# Altium schematic sheet Voltage_Sensing.SchDoc
size A; SheetNumber: 7; SheetTotal: 9
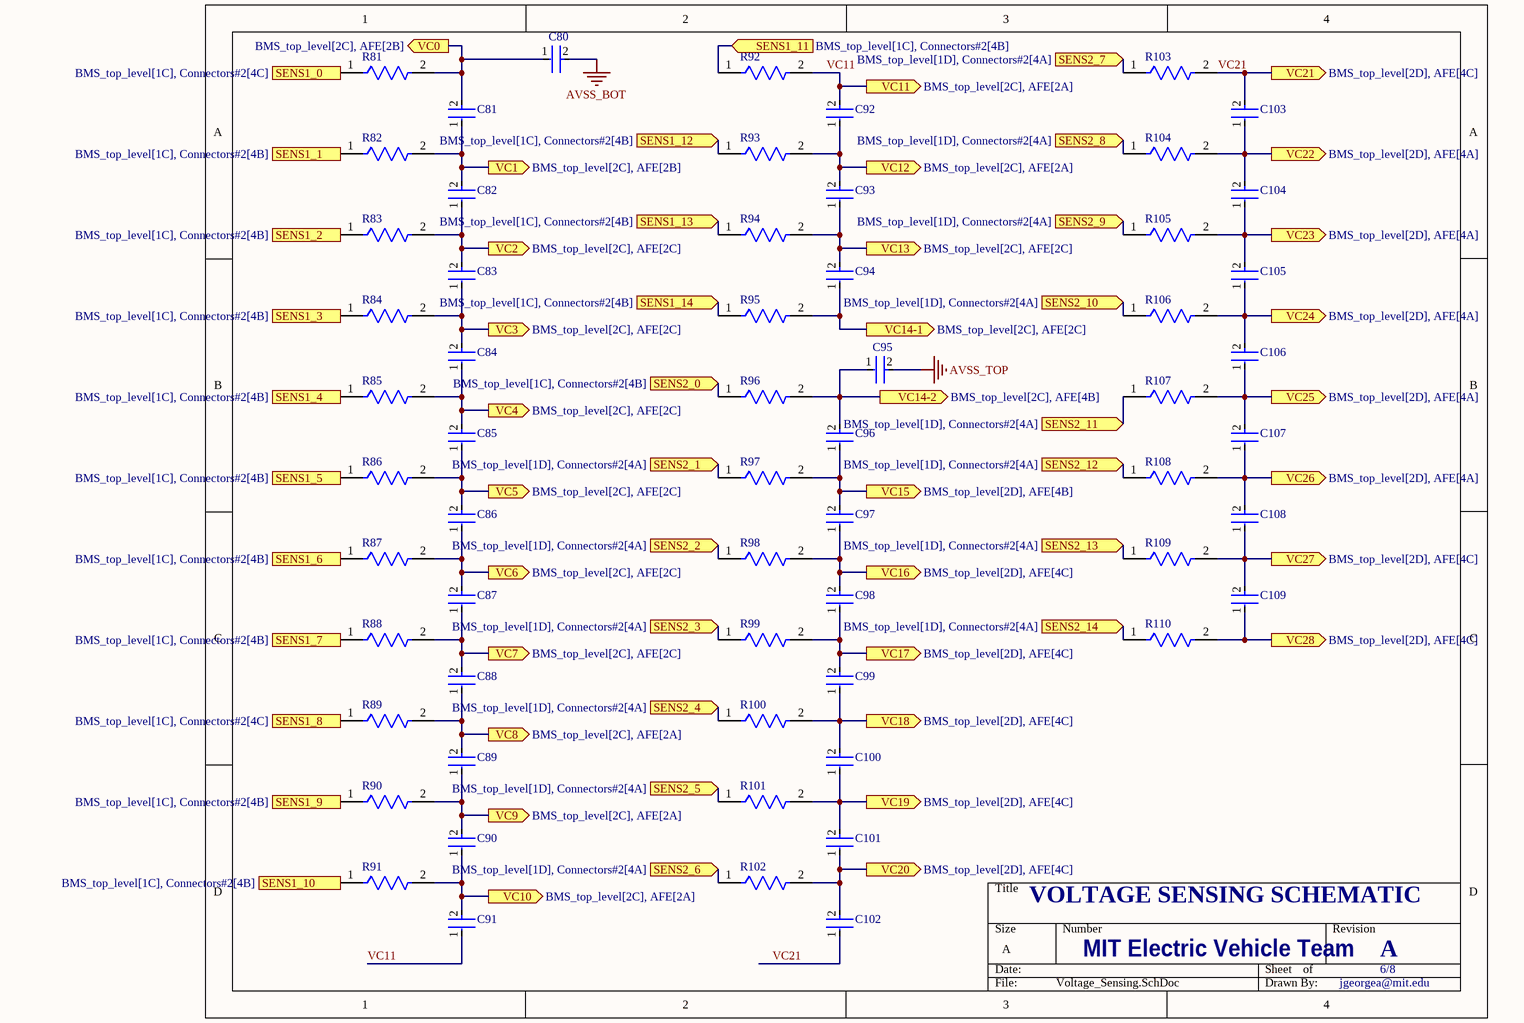
[diagram p0: Voltage_Sensing.SchDoc]

## Parts
C80  C1608X7R1C474K080AC  [FP-C1608-080-0_1-IPC_C]  (value not drawn)
C81  C1608X7R1C474K080AC  [FP-C1608-080-0_1-IPC_C]  (value not drawn)
C82  C1608X7R1C474K080AC  [FP-C1608-080-0_1-IPC_C]  (value not drawn)
C83  C1608X7R1C474K080AC  [FP-C1608-080-0_1-IPC_C]  (value not drawn)
C84  C1608X7R1C474K080AC  [FP-C1608-080-0_1-IPC_C]  (value not drawn)
C85  C1608X7R1C474K080AC  [FP-C1608-080-0_1-IPC_C]  (value not drawn)
C86  C1608X7R1C474K080AC  [FP-C1608-080-0_1-IPC_C]  (value not drawn)
C87  C1608X7R1C474K080AC  [FP-C1608-080-0_1-IPC_C]  (value not drawn)
C88  C1608X7R1C474K080AC  [FP-C1608-080-0_1-IPC_C]  (value not drawn)
C89  C1608X7R1C474K080AC  [FP-C1608-080-0_1-IPC_C]  (value not drawn)
C90  C1608X7R1C474K080AC  [FP-C1608-080-0_1-IPC_C]  (value not drawn)
C91  C1608X7R1C474K080AC  [FP-C1608-080-0_1-IPC_C]  (value not drawn)
C92  C1608X7R1C474K080AC  [FP-C1608-080-0_1-IPC_C]  (value not drawn)
C93  C1608X7R1C474K080AC  [FP-C1608-080-0_1-IPC_C]  (value not drawn)
C94  C1608X7R1C474K080AC  [FP-C1608-080-0_1-IPC_C]  (value not drawn)
C95  C1608X7R1C474K080AC  [FP-C1608-080-0_1-IPC_C]  (value not drawn)
C96  C1608X7R1C474K080AC  [FP-C1608-080-0_1-IPC_C]  (value not drawn)
C97  C1608X7R1C474K080AC  [FP-C1608-080-0_1-IPC_C]  (value not drawn)
C98  C1608X7R1C474K080AC  [FP-C1608-080-0_1-IPC_C]  (value not drawn)
C99  C1608X7R1C474K080AC  [FP-C1608-080-0_1-IPC_C]  (value not drawn)
C100  C1608X7R1C474K080AC  [FP-C1608-080-0_1-IPC_C]  (value not drawn)
C101  C1608X7R1C474K080AC  [FP-C1608-080-0_1-IPC_C]  (value not drawn)
C102  C1608X7R1C474K080AC  [FP-C1608-080-0_1-IPC_C]  (value not drawn)
C103  C1608X7R1C474K080AC  [FP-C1608-080-0_1-IPC_C]  (value not drawn)
C104  C1608X7R1C474K080AC  [FP-C1608-080-0_1-IPC_C]  (value not drawn)
C105  C1608X7R1C474K080AC  [FP-C1608-080-0_1-IPC_C]  (value not drawn)
C106  C1608X7R1C474K080AC  [FP-C1608-080-0_1-IPC_C]  (value not drawn)
C107  C1608X7R1C474K080AC  [FP-C1608-080-0_1-IPC_C]  (value not drawn)
C108  C1608X7R1C474K080AC  [FP-C1608-080-0_1-IPC_C]  (value not drawn)
C109  C1608X7R1C474K080AC  [FP-C1608-080-0_1-IPC_C]  (value not drawn)
R81  CRCW0805100RJNEAHP  [FP-CRCW0805-HPe3-IPC_C]  (value not drawn)
R82  CRCW0805100RJNEAHP  [FP-CRCW0805-HPe3-IPC_C]  (value not drawn)
R83  CRCW0805100RJNEAHP  [FP-CRCW0805-HPe3-IPC_C]  (value not drawn)
R84  CRCW0805100RJNEAHP  [FP-CRCW0805-HPe3-IPC_C]  (value not drawn)
R85  CRCW0805100RJNEAHP  [FP-CRCW0805-HPe3-IPC_C]  (value not drawn)
R86  CRCW0805100RJNEAHP  [FP-CRCW0805-HPe3-IPC_C]  (value not drawn)
R87  CRCW0805100RJNEAHP  [FP-CRCW0805-HPe3-IPC_C]  (value not drawn)
R88  CRCW0805100RJNEAHP  [FP-CRCW0805-HPe3-IPC_C]  (value not drawn)
R89  CRCW0805100RJNEAHP  [FP-CRCW0805-HPe3-IPC_C]  (value not drawn)
R90  CRCW0805100RJNEAHP  [FP-CRCW0805-HPe3-IPC_C]  (value not drawn)
R91  CRCW0805100RJNEAHP  [FP-CRCW0805-HPe3-IPC_C]  (value not drawn)
R92  CRCW0805100RJNEAHP  [FP-CRCW0805-HPe3-IPC_C]  (value not drawn)
R93  CRCW0805100RJNEAHP  [FP-CRCW0805-HPe3-IPC_C]  (value not drawn)
R94  CRCW0805100RJNEAHP  [FP-CRCW0805-HPe3-IPC_C]  (value not drawn)
R95  CRCW0805100RJNEAHP  [FP-CRCW0805-HPe3-IPC_C]  (value not drawn)
R96  CRCW0805100RJNEAHP  [FP-CRCW0805-HPe3-IPC_C]  (value not drawn)
R97  CRCW0805100RJNEAHP  [FP-CRCW0805-HPe3-IPC_C]  (value not drawn)
R98  CRCW0805100RJNEAHP  [FP-CRCW0805-HPe3-IPC_C]  (value not drawn)
R99  CRCW0805100RJNEAHP  [FP-CRCW0805-HPe3-IPC_C]  (value not drawn)
R100  CRCW0805100RJNEAHP  [FP-CRCW0805-HPe3-IPC_C]  (value not drawn)
R101  CRCW0805100RJNEAHP  [FP-CRCW0805-HPe3-IPC_C]  (value not drawn)
R102  CRCW0805100RJNEAHP  [FP-CRCW0805-HPe3-IPC_C]  (value not drawn)
R103  CRCW0805100RJNEAHP  [FP-CRCW0805-HPe3-IPC_C]  (value not drawn)
R104  CRCW0805100RJNEAHP  [FP-CRCW0805-HPe3-IPC_C]  (value not drawn)
R105  CRCW0805100RJNEAHP  [FP-CRCW0805-HPe3-IPC_C]  (value not drawn)
R106  CRCW0805100RJNEAHP  [FP-CRCW0805-HPe3-IPC_C]  (value not drawn)
R107  CRCW0805100RJNEAHP  [FP-CRCW0805-HPe3-IPC_C]  (value not drawn)
R108  CRCW0805100RJNEAHP  [FP-CRCW0805-HPe3-IPC_C]  (value not drawn)
R109  CRCW0805100RJNEAHP  [FP-CRCW0805-HPe3-IPC_C]  (value not drawn)
R110  CRCW0805100RJNEAHP  [FP-CRCW0805-HPe3-IPC_C]  (value not drawn)

## Ports
SENS1_0 (in, see BMS_top_level[1C], Connectors#2[4C]), SENS1_1 (in, see BMS_top_level[1C], Connectors#2[4B]), SENS1_2 (in, see BMS_top_level[1C], Connectors#2[4B]), SENS1_3 (in, see BMS_top_level[1C], Connectors#2[4B]), SENS1_4 (in, see BMS_top_level[1C], Connectors#2[4B]), SENS1_5 (in, see BMS_top_level[1C], Connectors#2[4B]), SENS1_6 (in, see BMS_top_level[1C], Connectors#2[4B]), SENS1_7 (in, see BMS_top_level[1C], Connectors#2[4B]), SENS1_8 (in, see BMS_top_level[1C], Connectors#2[4C]), SENS1_9 (in, see BMS_top_level[1C], Connectors#2[4B]), SENS1_10 (in, see BMS_top_level[1C], Connectors#2[4B]), SENS1_11 (in, see BMS_top_level[1C], Connectors#2[4B]), SENS1_12 (in, see BMS_top_level[1C], Connectors#2[4B]), SENS1_13 (in, see BMS_top_level[1C], Connectors#2[4B]), SENS1_14 (in, see BMS_top_level[1C], Connectors#2[4B]), SENS2_0 (in, see BMS_top_level[1C], Connectors#2[4B]), SENS2_1 (in, see BMS_top_level[1D], Connectors#2[4A]), SENS2_2 (in, see BMS_top_level[1D], Connectors#2[4A]), SENS2_3 (in, see BMS_top_level[1D], Connectors#2[4A]), SENS2_4 (in, see BMS_top_level[1D], Connectors#2[4A]), SENS2_5 (in, see BMS_top_level[1D], Connectors#2[4A]), SENS2_6 (in, see BMS_top_level[1D], Connectors#2[4A]), SENS2_7 (in, see BMS_top_level[1D], Connectors#2[4A]), SENS2_8 (in, see BMS_top_level[1D], Connectors#2[4A]), SENS2_9 (in, see BMS_top_level[1D], Connectors#2[4A]), SENS2_10 (in, see BMS_top_level[1D], Connectors#2[4A]), SENS2_11 (in, see BMS_top_level[1D], Connectors#2[4A]), SENS2_12 (in, see BMS_top_level[1D], Connectors#2[4A]), SENS2_13 (in, see BMS_top_level[1D], Connectors#2[4A]), SENS2_14 (in, see BMS_top_level[1D], Connectors#2[4A]), VC0 (out, see BMS_top_level[2C], AFE[2B]), VC1 (out, see BMS_top_level[2C], AFE[2B]), VC2 (out, see BMS_top_level[2C], AFE[2C]), VC3 (out, see BMS_top_level[2C], AFE[2C]), VC4 (out, see BMS_top_level[2C], AFE[2C]), VC5 (out, see BMS_top_level[2C], AFE[2C]), VC6 (out, see BMS_top_level[2C], AFE[2C]), VC7 (out, see BMS_top_level[2C], AFE[2C]), VC8 (out, see BMS_top_level[2C], AFE[2A]), VC9 (out, see BMS_top_level[2C], AFE[2A]), VC10 (out, see BMS_top_level[2C], AFE[2A]), VC11 (out, see BMS_top_level[2C], AFE[2A]), VC12 (out, see BMS_top_level[2C], AFE[2A]), VC13 (out, see BMS_top_level[2C], AFE[2C]), VC14-1 (out, see BMS_top_level[2C], AFE[2C]), VC14-2 (out, see BMS_top_level[2C], AFE[4B]), VC15 (out, see BMS_top_level[2D], AFE[4B]), VC16 (out, see BMS_top_level[2D], AFE[4C]), VC17 (out, see BMS_top_level[2D], AFE[4C]), VC18 (out, see BMS_top_level[2D], AFE[4C]), VC19 (out, see BMS_top_level[2D], AFE[4C]), VC20 (out, see BMS_top_level[2D], AFE[4C]), VC21 (out, see BMS_top_level[2D], AFE[4C]), VC22 (out, see BMS_top_level[2D], AFE[4A]), VC23 (out, see BMS_top_level[2D], AFE[4A]), VC24 (out, see BMS_top_level[2D], AFE[4A]), VC25 (out, see BMS_top_level[2D], AFE[4A]), VC26 (out, see BMS_top_level[2D], AFE[4A]), VC27 (out, see BMS_top_level[2D], AFE[4C]), VC28 (out, see BMS_top_level[2D], AFE[4C])

## Nets
AVSS_BOT: C80.2
AVSS_TOP: C95.2
SENS1_0: R81.1 ; port SENS1_0
SENS1_1: R82.1 ; port SENS1_1
SENS1_2: R83.1 ; port SENS1_2
SENS1_3: R84.1 ; port SENS1_3
SENS1_4: R85.1 ; port SENS1_4
SENS1_5: R86.1 ; port SENS1_5
SENS1_6: R87.1 ; port SENS1_6
SENS1_7: R88.1 ; port SENS1_7
SENS1_8: R89.1 ; port SENS1_8
SENS1_9: R90.1 ; port SENS1_9
SENS1_10: R91.1 ; port SENS1_10
SENS1_11: R92.1 ; port SENS1_11
SENS1_12: R93.1 ; port SENS1_12
SENS1_13: R94.1 ; port SENS1_13
SENS1_14: R95.1 ; port SENS1_14
SENS2_0: R96.1 ; port SENS2_0
SENS2_1: R97.1 ; port SENS2_1
SENS2_2: R98.1 ; port SENS2_2
SENS2_3: R99.1 ; port SENS2_3
SENS2_4: R100.1 ; port SENS2_4
SENS2_5: R101.1 ; port SENS2_5
SENS2_6: R102.1 ; port SENS2_6
SENS2_7: R103.1 ; port SENS2_7
SENS2_8: R104.1 ; port SENS2_8
SENS2_9: R105.1 ; port SENS2_9
SENS2_10: R106.1 ; port SENS2_10
SENS2_11: R107.1 ; port SENS2_11
SENS2_12: R108.1 ; port SENS2_12
SENS2_13: R109.1 ; port SENS2_13
SENS2_14: R110.1 ; port SENS2_14
VC0: C80.1 C81.2 R81.2 ; port VC0
VC1: C81.1 C82.2 R82.2 ; port VC1
VC2: C82.1 C83.2 R83.2 ; port VC2
VC3: C83.1 C84.2 R84.2 ; port VC3
VC4: C84.1 C85.2 R85.2 ; port VC4
VC5: C85.1 C86.2 R86.2 ; port VC5
VC6: C86.1 C87.2 R87.2 ; port VC6
VC7: C87.1 C88.2 R88.2 ; port VC7
VC8: C88.1 C89.2 R89.2 ; port VC8
VC9: C89.1 C90.2 R90.2 ; port VC9
VC10: C90.1 C91.2 R91.2 ; port VC10
VC11: C91.1 C92.2 R92.2 ; port VC11
VC12: C92.1 C93.2 R93.2 ; port VC12
VC13: C93.1 C94.2 R94.2 ; port VC13
VC14-1: C94.1 R95.2 ; port VC14-1
VC14-2: C95.1 C96.2 R96.2 ; port VC14-2
VC15: C96.1 C97.2 R97.2 ; port VC15
VC16: C97.1 C98.2 R98.2 ; port VC16
VC17: C98.1 C99.2 R99.2 ; port VC17
VC18: C99.1 C100.2 R100.2 ; port VC18
VC19: C100.1 C101.2 R101.2 ; port VC19
VC20: C101.1 C102.2 R102.2 ; port VC20
VC21: C102.1 C103.2 R103.2 ; port VC21
VC22: C103.1 C104.2 R104.2 ; port VC22
VC23: C104.1 C105.2 R105.2 ; port VC23
VC24: C105.1 C106.2 R106.2 ; port VC24
VC25: C106.1 C107.2 R107.2 ; port VC25
VC26: C107.1 C108.2 R108.2 ; port VC26
VC27: C108.1 C109.2 R109.2 ; port VC27
VC28: C109.1 R110.2 ; port VC28

## Notes on the sheet
- VOLTAGE SENSING SCHEMATIC
- MIT Electric Vehicle Team
- A
- 6/8
- jgeorgea@mit.edu

## Library data of the parts
C80-C109 = CMP-08246-006173-1: Multilayer Ceramic Capacitors 470nF ±10% 16V X7R SMD 0603; REACH SVHC: No SVHC; Number of Pins: 2; Thickness: 0.037inch; Lead Free: Lead Free; Voltage: 16V; Case Code (Imperial): 0603; Capacitance: 470nF; Length: 1.6mm; Dielectric: X7R; Resistor Type: Ceramic; Weight: 7.1E-05oz; Termination: SMD/SMT; Radiation Hardening: No; RoHS Compliant: Yes; Dielectric Material: Ceramic; Case Code (Metric): 1608; Construction: Flat; Voltage Rating (DC): 16V; Package Quantity: 1; Mount: Surface Mount; Min Operating Temperature: -55°C; Case/Package: 0603; Series: C; Max Operating Temperature: 125°C; Depth: 0.8mm; Voltage Rating: 16V; Width: 0.031inch; Tolerance: 10%; Height: 0.8mm; Packaging: Tape and Reel
R81-R110 = CMP-02407-002130-1: RES Thick Film, 100Ω, 5%, 0.5W, 200ppm/°C, 0805; Voltage Rating: 150V; Resistance: 100R; Power Rating: 330mW; Max Power Dissipation: 333mW; Max Operating Temperature: 155°C; Temperature Coefficient: 200ppm/°C; Case Code (Imperial): 0805; Lead Free: Lead Free; Composition: Thick Film; Case/Package: 0805; Package Quantity: 1; Number of Terminations: 2; Contact Plating: Tin; Radiation Hardening: No; Case Code (Metric): 2012; Height: 0.024inch; Features: Automotive AEC-Q200; Length: 0.079inch; Tolerance: 5%; Width: 0.049inch; Packaging: Tape and Reel; Termination: SMD/SMT; Weight: 0.000194oz; Min Operating Temperature: -55°C